# EAGLE design touch_board (EAGLE 9.6.2)
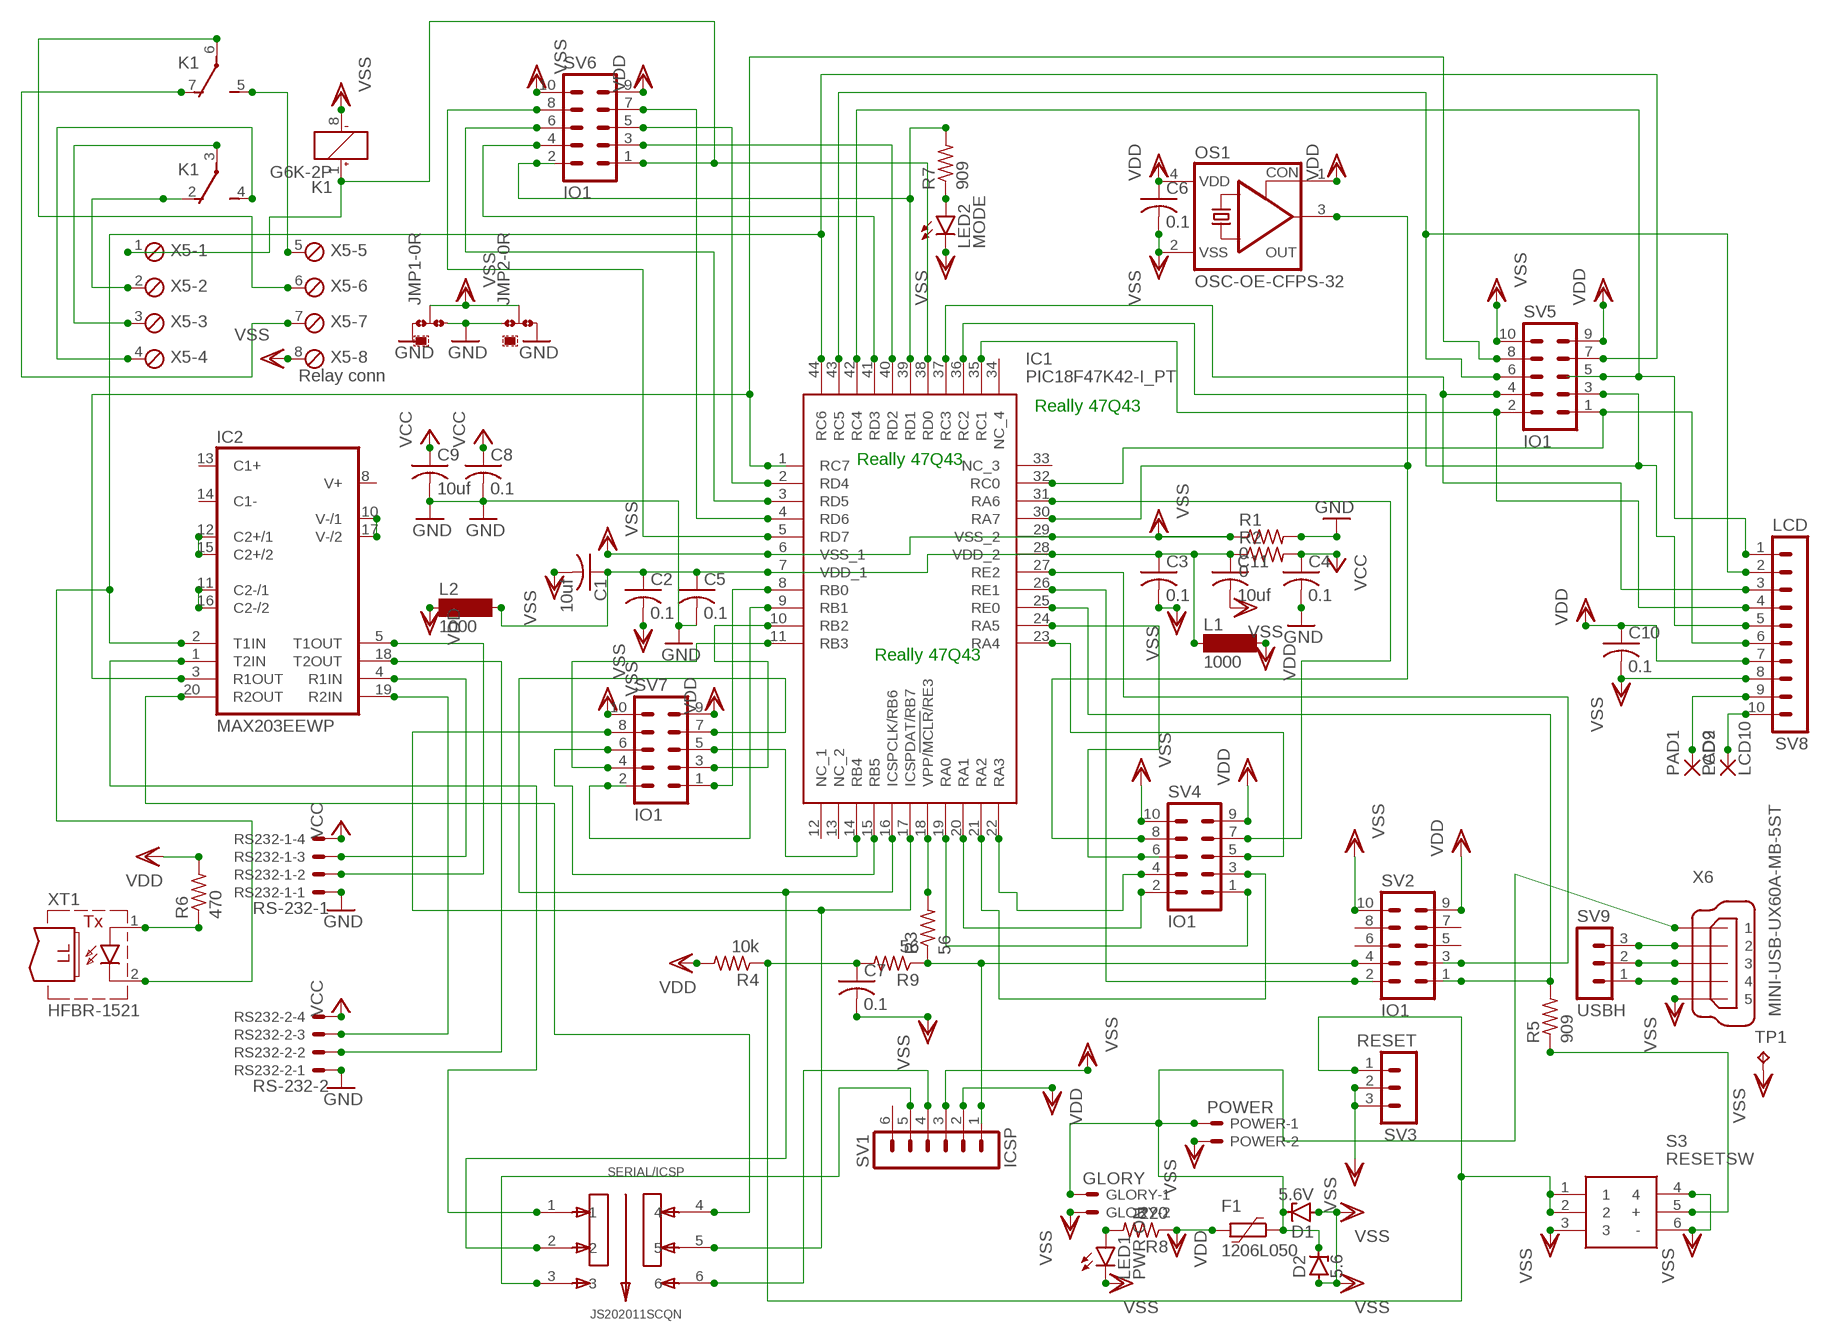
[diagram p0: schematic, sheet 1]

## Parts
C1  10uf  C-USC0805  [C0805]
C2  0.1  C-USC0805  [C0805]
C3  0.1  C-USC0805  [C0805]
C4  0.1  C-USC0805  [C0805]
C5  0.1  C-USC0805  [C0805]
C6  0.1  C-USC0805  [C0805]
C7  0.1  C-USC0805  [C0805]
C8  0.1  C-USC0805  [C0805]
C9  10uf  C-USC0805  [C0805]
C10  0.1  C-USC0805  [C0805]
C11  10uf  C-USC0805  [C0805]
D1  5.6V  ZENER-DIODEZD-7.5  [ZDIO-7.5]
D2  5.6  ZENER-DIODESMB  [SMB]
F1  1206L050  [1206L]
GLORY  GLORY  22-23-2021  [22-23-2021]
IC1  PIC18F47K42-I_PT  [QFP80P1200X1200X120-44N]
IC2  MAX203EEWP  [SO20L]
JMP1  0R-JUMPA  [A0R-JMP]
JMP2  0R-JUMPA  [A0R-JMP]
K1  G6K-2P  [G6K-2P]
L1  1000  SM-1206  [SM-1206]
L2  1000  SM-1206  [SM-1206]
LED1  PWR ON  LEDCHIPLED_1206  [CHIPLED_1206]
LED2  MODE  LEDCHIPLED_1206  [CHIPLED_1206]
OS1  OSC-OE-CFPS-32  [7.2X5.2-4-PAD]
PAD1  LCD9  SMD2  [SMD1,27-2,54]
PAD2  LCD10  SMD2  [SMD1,27-2,54]
POWER  POWER  22-23-2021  [22-23-2021]
R1  0  R-US_R0805  [R0805]
R2  0  R-US_R0805  [R0805]
R3  56  R-US_R0805  [R0805]
R4  10k  R-US_R0805  [R0805]
R5  909  R-US_R0805  [R0805]
R6  470  R-US_R0805  [R0805]
R7  909  R-US_R0805  [R0805]
R8  220  R-US_R0805  [R0805]
R9  56  R-US_R0805  [R0805]
RS232-1  RS-232-1  22-23-2041  [22-23-2041]
RS232-2  RS-232-2  22-23-2041  [22-23-2041]
S3  RESETSW  B3W-9000-Y1N  [B3W-9_1-LED]
SERIAL/ICSP  JS202011SCQN  [SW_JS202011SCQN]
SV1  ICSP  MA06-1  [MA06-1]
SV2  IO1  MA05-2  [MA05-2]
SV3  RESET  MA03-1  [MA03-1]
SV4  IO1  MA05-2  [MA05-2]
SV5  IO1  MA05-2  [MA05-2]
SV6  IO1  MA05-2  [MA05-2]
SV7  IO1  MA05-2  [MA05-2]
SV8  LCD  MA10-1  [MA10-1]
SV9  USBH  MA03-1  [MA03-1]
TP1  TPB1,27  [B1,27]
X5  Relay conn  MPT8  [8POL254]
X6  MINI-USB-UX60A-MB-5ST  [UX60A-MB-5ST]
XT1  HFBR-1521  [HFBR-15X3]

## Nets
GND: C4.2 C5.2 C8.2 C9.2 JMP1.1 JMP1.3 JMP2.1 JMP2.3 R1.2 RS232-1.1 RS232-2.1
N$1: IC1.30(RA7) OS1.3(OUT) SV4.8
N$2: R3.1 R9.1 SV1.1 SV2.4
N$3: IC1.18(VPP/!MCLR!/RE3) R3.2
N$4: IC1.25(RE0) R5.2 SV2.1
N$5: IC1.26(RE1) SV2.2
N$6: IC1.17(ICSPDAT/RB7) SERIAL/ICSP.5 SV7.8
N$7: IC1.16(ICSPCLK/RB6) SERIAL/ICSP.2 SV7.7
N$8: IC1.27(RE2) SV2.3
N$9: R5.1 S3.5(+)
N$10: IC1.39(RD1) R7.2 SV6.2
N$11: LED2.A R7.1
N$12: IC2.11(C2-/1) IC2.16(C2-/2)
N$13: IC2.10(V-/1) IC2.17(V-/2)
N$14: IC2.12(C2+/1) IC2.15(C2+/2)
N$15: IC2.5(T1OUT) RS232-1.2
N$16: IC2.18(T2OUT) RS232-2.2
N$17: IC2.4(R1IN) RS232-1.3
N$18: IC2.19(R2IN) RS232-2.3
N$20: IC2.1(T2IN) SERIAL/ICSP.1
N$21: IC1.1(RC7) IC2.3(R1OUT) SV5.8
N$22: IC2.20(R2OUT) SERIAL/ICSP.4
N$23: SERIAL/ICSP.6 SV1.4
N$24: IC1.44(RC6) IC2.2(T1IN) SV5.7 XT1.2(C)
N$25: R6.1 XT1.1(A)
N$26: IC1.19(RA0) SV4.1
N$27: IC1.20(RA1) SV4.2
N$28: IC1.21(RA2) SV4.3
N$29: IC1.22(RA3) SV4.4
N$30: IC1.23(RA4) SV4.5
N$31: IC1.31(RA6) SV4.7
N$32: IC1.24(RA5) SV4.6
N$33: IC1.32(RC0) SV5.1 SV8.6
N$34: IC1.35(RC1) SV5.2 SV8.4
N$35: IC1.36(RC2) SV5.3 SV8.5
N$36: IC1.37(RC3) SV5.4 SV8.3
N$37: LED1.A R8.2
N$38: IC1.43(RC5) SV5.6 SV8.2
N$39: K1.2(2:O) X5.2
N$40: IC1.40(RD2) SV6.3
N$41: IC1.41(RD3) SV6.4
N$42: IC1.2(RD4) SV6.5
N$43: IC1.3(RD5) SV6.6
N$44: IC1.4(RD6) SV6.7
N$45: IC1.5(RD7) SV6.8
N$46: IC1.8(RB0) SV7.1
N$47: IC1.9(RB1) SV7.2
N$48: IC1.10(RB2) SV7.3
N$49: IC1.11(RB3) SV7.4
N$50: IC1.14(RB4) SV7.5
N$51: IC1.15(RB5) SV7.6
N$52: IC1.38(RD0) K1.1(1:+) SV6.1 X5.1
N$53: K1.3(2:P) X5.3
N$54: K1.4(2:S) X5.4
N$55: K1.5(3:S) X5.5
N$56: K1.6(3:P) X5.6
N$57: K1.7(3:O) X5.7
N$58: C1.1 C2.1 C3.1 C5.1 C11.1 IC1.7(VDD_1) IC1.28(VDD_2) L1.1 L2.2 R2.1
N$59: SV9.3 X6.2
N$60: D1.C D2.C F1.1 GLORY.1 POWER.1 X6.1
N$61: SV9.2 X6.3
N$62: C7.1 R4.1 R9.2 S3.1 S3.2 SV3.1
N$63: IC1.42(RC4) SV5.5 SV8.1
N$64: SV9.1 X6.4
N$65: SERIAL/ICSP.3 SV1.5
N$66: PAD1.1(P) SV8.9
N$67: PAD2.1(P) SV8.10
VCC: C4.1 C8.1 C9.1 R2.2 RS232-1.4 RS232-2.4
VDD: C6.1 C10.1 F1.2 L1.2 L2.1 OS1.1(CON) OS1.4(VDD) R4.2 R6.2 R8.1 SV1.2 SV2.9 SV4.9 SV5.9 SV6.9 SV7.9 SV8.7
VSS: C1.2 C2.2 C3.2 C6.2 C7.2 C10.2 C11.2 D1.A D2.A GLORY.2 IC1.6(VSS_1) IC1.29(VSS_2) JMP1.2 JMP2.2 K1.8(1:-) LED1.C LED2.C OS1.2(VSS) POWER.2 R1.1 S3.3 S3.4 S3.6(-) SV1.3 SV2.10 SV3.2 SV3.3 SV4.10 SV5.10 SV6.10 SV7.10 SV8.8 TP1.TP X5.8 X6.5
Unconnected: IC1.12(NC_1) IC1.13(NC_2) IC1.33(NC_3) IC1.34(NC_4) IC2.8(V+) IC2.13(C1+) IC2.14(C1-) SV1.6 SV2.5 SV2.6 SV2.7 SV2.8

## Notes on the sheet
- Really 47Q43
- Really 47Q43
- Really 47Q43

## Power pins joined to a net without a drawn wire
GND: IC2.6(GND) IC2.9(GND)
VCC: IC2.7(VCC)

## Library data of the parts
C1-C11 = rcl:C-US: CAPACITOR, American symbol; SPICEPREFIX: C
D1 D2 = diode:ZENER-DIODE: Z-Diode
F1 = polyfuse-smd_10:?: Polyfuse Resettable PTC Source: http://www.littelfuse.com/products/resettable-ptcs.aspx; MF: Littelfuse; MPN: 1206L050; OC_FARNELL: 1596993; OC_NEWARK: 53M6118
GLORY POWER = con-molex:22-23-2021: .100" (2.54mm) Center Header - 2 Pin; MF: MOLEX; MPN: 22-23-2021; OC_FARNELL: 1462926; OC_NEWARK: 25C3832
IC1 = PIC18F47K42-I_PT:PIC18F47K42-I_PT: MICROCHIP - PIC18F47K42-I/PT - MCU, 8BIT, 64MHZ, TQFP-44 Source: Datasheet <https://www.microchip.com/wwwproducts/en/PIC18F47K42#additional-features>; DESCRIPTION: MICROCHIP - PIC18F47K42-I/PT - MCU, 8BIT, 64MHZ, TQFP-44; HEIGHT: 1.2mm; MANUFACTURER_NAME: Microchip; MANUFACTURER_PART_NUMBER: PIC18F47K42-I/PT; MOUSER_PART_NUMBER: 579-PIC18F47K42-I/PT; MOUSER_PRICE-STOCK: https://www.mouser.com/Search/Refine.aspx?Keyword=579-PIC18F47K42-I%2FPT
IC2 = maxim-10:MAX203*: RS232 TRANSEIVER
JMP1 JMP2 = jump-0r-smd:0R-JUMP: SMD 0R 0805 Jumper
K1 = relay:G6K: Low Signal Relay oeiwcsnts1.omron.com/.. D20G6K0100.pdf; MF: OMRON COMPONENTS USA; MPN: G6K-2P DC3; OC_FARNELL: 3937276; OC_NEWARK: 89C6482
L1 L2 = inductor-neosid:SM-1206: INDUCTOR SMD chip inductor; OC_FARNELL: unknown; OC_NEWARK: unknown
LED1 LED2 = led:LED: LED OSRAM: - CHIPLED LG R971, LG N971, LY N971, LG Q971, LY Q971, LO R971, LY R971 LH N974, LH R974 LS Q976, LO Q976, LY Q976 LO Q996 - Hyper CHIPLED LW Q18S LB Q993, LB Q99A, LB R99A - SideLED LS A670, LO A670, LY A670, LG A670, LP A670 LB A673, LV A673, LT A673, LW A673 LH A674 LY A675 LS A676, LA A676, LO A676, LY A676, LW A676 LS A679, LY A679, LG A679 - Hyper Micro SIDELED® LS Y876, LA Y876, LO Y876, LY Y876 LT Y87S - SmartLED LW L88C, LW L88S LB L89C, LB L89S, LG L890 LS L89K, LO L89K, LY L89K LS L896, LA L896, LO L896, LY L896 - TOPLED LS T670, LO T670, LY T670, LG T670, LP T670 LSG T670, LSP T670, LSY T670, LOP T670, LYG T670 LG T671, LOG T671, LSG T671 LB T673, LV T673, LT T673, LW T673 LH T674 LS T676, LA T676, LO T676, LY T676, LB T676, LH T676, LSB T676, LW T676 LB T67C, LV T67C, LT T67C, LS T67K, LO T67K, LY T67K, LW E67C LS E67B, LA E67B, LO E67B, LY E67B, LB E67C, LV E67C, LT E67C LW T67C LS T679, LY T679, LG T679 LS T770, LO T770, LY T770, LG T770, LP T770 LB T773, LV T773, LT T773, LW T773 LH T774 LS E675, LA E675, LY E675, LS T675 LS T776, LA T776, LO T776, LY T776, LB T776 LHGB T686 LT T68C, LB T68C - Hyper Mini TOPLED® LB M676 - Mini TOPLED Santana® LG M470 LS M47K, LO M47K, LY M47K Source: http://www.osram.convergy.de LUXEON: - LUMILED® LXK2-PW12-R00, LXK2-PW12-S00, LXK2-PW14-U00, LXK2-PW14-V00 LXK2-PM12-R00, LXK2-PM12-S00, LXK2-PM14-U00 LXK2-PE12-Q00, LXK2-PE12-R00, LXK2-PE12-S00, LXK2-PE14-T00, LXK2-PE14-U00 LXK2-PB12-K00, LXK2-PB12-L00, LXK2-PB12-M00, LXK2-PB14-N00, LXK2-PB14-P00, LXK2-PB14-Q00 LXK2-PR12-L00, LXK2-PR12-M00, LXK2-PR14-Q00, LXK2-PR14-R00 LXK2-PD12-Q00, LXK2-PD12-R00, LXK2-PD12-S00 LXK2-PH12-R00, LXK2-PH12-S00 LXK2-PL12-P00, LXK2-PL12-Q00, LXK2-PL12-R00 Source: www.luxeon.com KINGBRIGHT: KA-3528ASYC Source: www.kingbright.com
OS1 = IQD-Frequency-Products:OSC-OE: OSCILLATOR WITH OE
PAD1 PAD2 = wirepad:SMD2: SMD PAD
R1-R9 = rcl:R-US_: RESISTOR, American symbol; SPICEPREFIX: R
RS232-1 RS232-2 = con-molex:22-23-2041: .100" (2.54mm) Center Header - 4 Pin; MF: MOLEX; MPN: 22-23-2041; OC_FARNELL: 1462920; OC_NEWARK: 38C0355
S3 = SamacSys_Parts:B3W-9000-Y1N: Illuminated Tactile Switches Illuminated Ylw LED White Cap Source: Datasheet <http://www.mouser.com/ds/2/307/en-b3w-9-11824.pdf>; ALLIED_NUMBER: 70176005; ALLIED_PRICE-STOCK: https://www.alliedelec.com/omron-electronic-components-b3w-9000-y1n/70176005/; DESCRIPTION: Illuminated Tactile Switches Illuminated Ylw LED White Cap; HEIGHT: mm; MANUFACTURER_NAME: Omron Electronics; MANUFACTURER_PART_NUMBER: B3W-9000-Y1N; MOUSER_PART_NUMBER: 653-B3W-9000-Y1N; MOUSER_PRICE-STOCK: https://www.mouser.com/Search/Refine.aspx?Keyword=653-B3W-9000-Y1N; RS_PART_NUMBER: 0492777P; RS_PRICE-STOCK: http://uk.rs-online.com/web/p/products/0492777P
SERIAL/ICSP = JS202011SCQN_fixed:JS202011SCQN: JS Series DPDT On-On Gull Wing Surface Mount Subminiature Slide Switch; AVAILABILITY: Unavailable; DESCRIPTION: JS Series DPDT On-On Gull Wing Surface Mount Subminiature Slide Switch; MF: C&K; MP: JS202011SCQN; PACKAGE: None; PRICE: None
SV1 = con-lstb:MA06-1: PIN HEADER; OC_FARNELL: unknown; OC_NEWARK: unknown
SV2 SV4-SV7 = con-lstb:MA05-2: PIN HEADER; OC_FARNELL: unknown; OC_NEWARK: unknown
SV3 SV9 = con-lstb:MA03-1: PIN HEADER; OC_FARNELL: unknown; OC_NEWARK: unknown
SV8 = con-lstb:MA10-1: PIN HEADER; OC_FARNELL: unknown; OC_NEWARK: unknown
TP1 = testpad:TP: Test pad
X5 = con-phoenix-254:MPT8: PHOENIX CONNECTOR; OC_FARNELL: unknown; OC_NEWARK: unknown
X6 = con-hirose:MINI-USB-: MINI USB Connector Source: http://www.hirose.co.jp/cataloge_hp/e24000019.pdf; OC_FARNELL: unknown; OC_NEWARK: unknown
XT1 = fiber-optic-hp:HFBR-1521: TRANSMITTER low cost miniature fiber optic component, 5-MBd high performance link, vertical; MF: AGILENT TECHNOLOGIES; MPN: HFBR-1521; OC_FARNELL: 1173128; OC_NEWARK: 06F6050

## Board
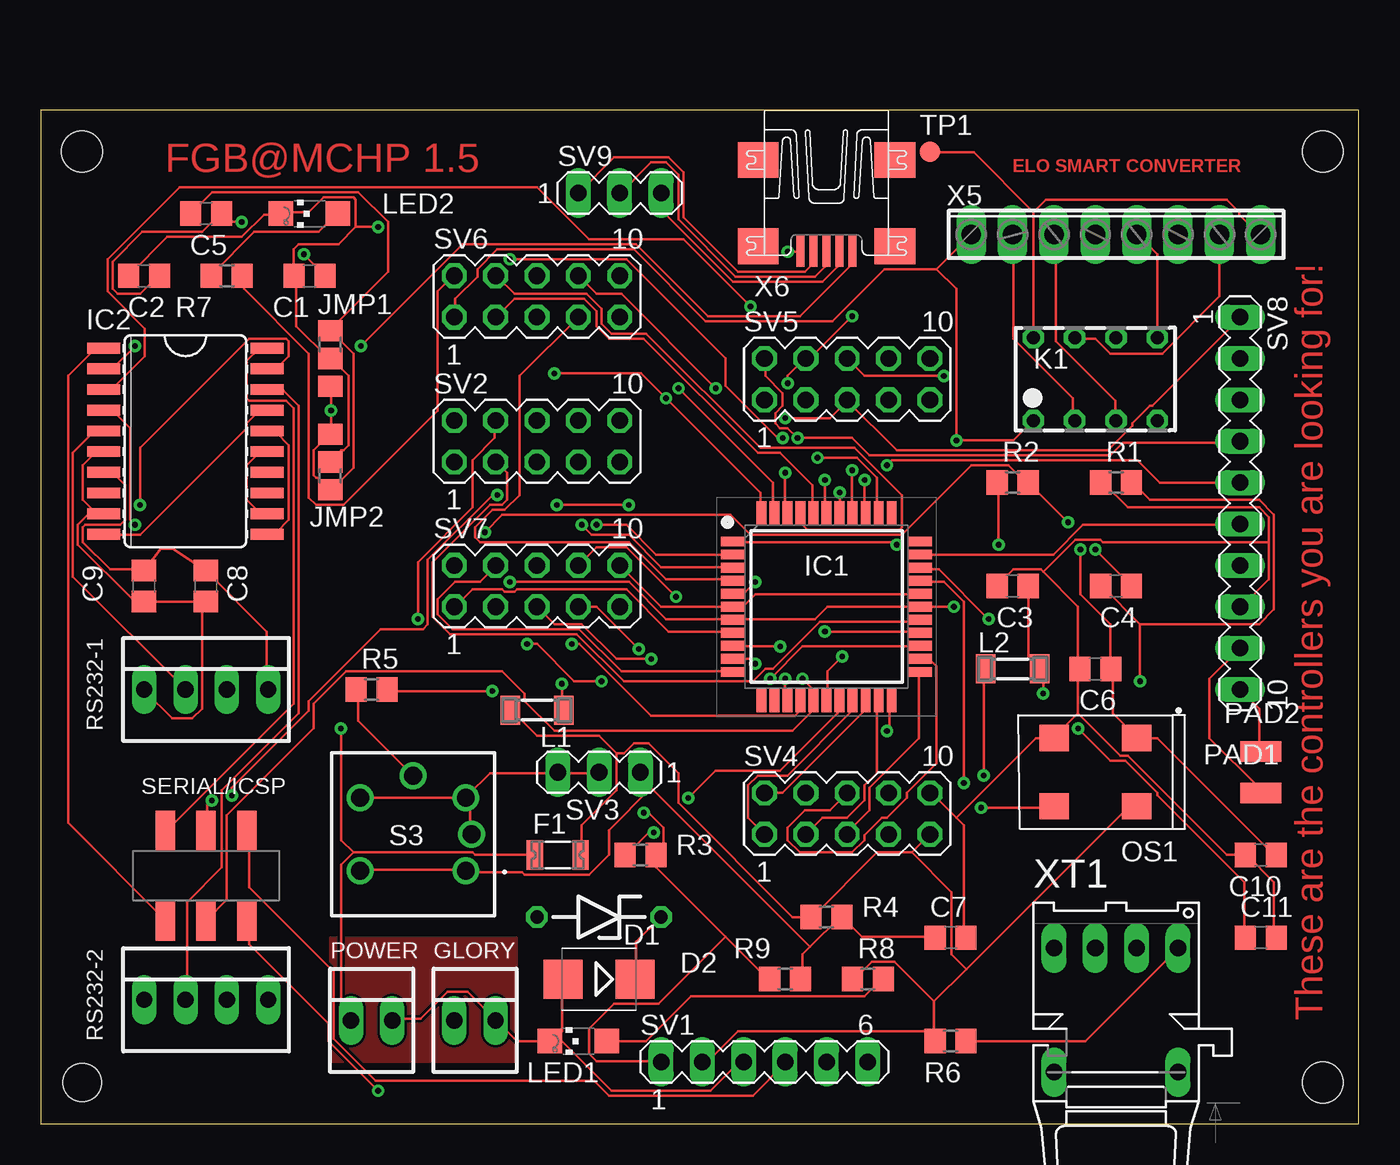
[diagram p1: board, top side]
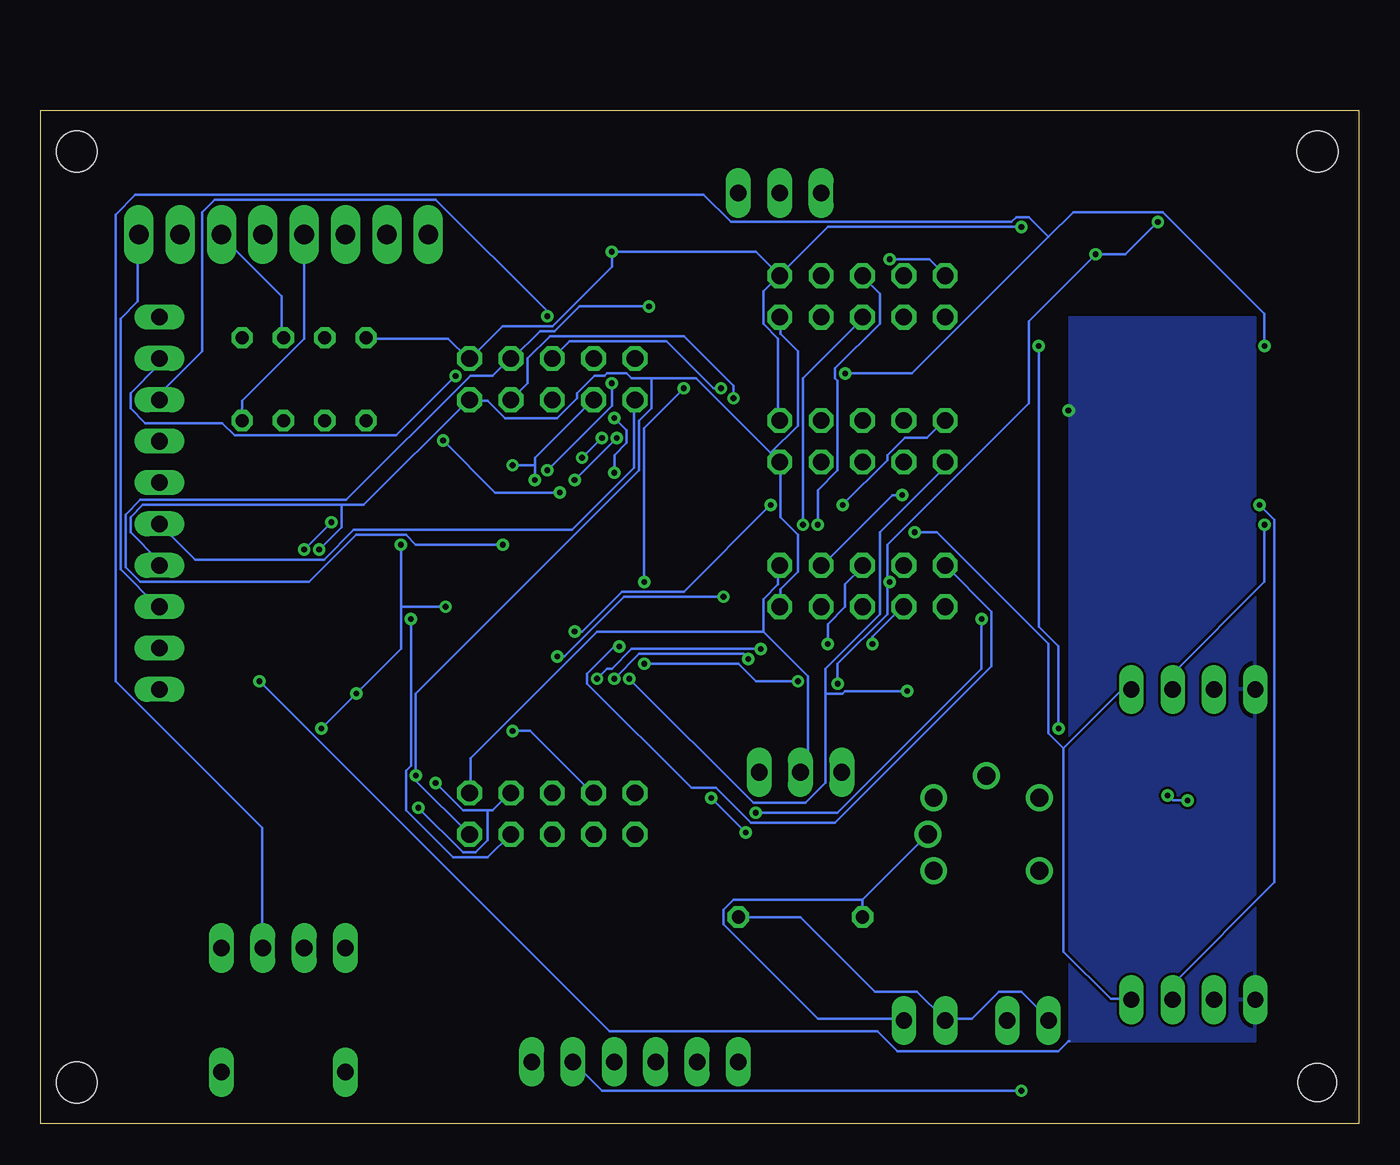
[diagram p2: board, bottom side, seen from below]

Size 80.95 x 62.22 mm. Coordinates in mm from the lower left corner, seen from the top.
Outline: 0,0 80.95,0 80.95,62.22 0,62.22 0,0
Copper layers (1*16): Top 0.035mm / dielectric 1.5mm / Bottom 0.035mm
Design rules "default": minimum track width 6mil, minimum drill 0.35mm, track to track 6mil, track to pad 6mil, pad to pad 6mil, via to via 6mil, smd to smd 6mil, copper to edge 40mil, drill to drill 6mil, minimum pad ring 10mil, minimum via ring 8mil, stop-mask expansion 4mil, vias tented up to drill 0mil, thermal gap 10mil
Holes 2.35 mm at 2.54,2.54
Holes 2.5 mm at 78.74,2.54 78.74,59.69 2.54,59.69

### Footprints (pad centres in the part's own frame; a part is rotated, then mirrored left to right if it is on the bottom)
C0805 = smd 1.3 x 1.5: 1 -0.95,0; 2 0.95,0
ZDIO-7.5 = drill 0.813 octagon: A 3.81,0; C -3.81,0
SMB = smd 2.4 x 2.4: A 2.2,0; C -2.2,0
1206L = smd 1 x 1.8: 1 -1.4,0; 2 1.4,0
22-23-2021 = drill 1 long: 1 -1.27,0; 2 1.27,0
QFP80P1200X1200X120-44N = smd 1.475 x 0.6: 1 -5.738,4; 2 -5.738,3.2; 3 -5.738,2.4; 4 -5.738,1.6; 5 -5.738,0.8; 6 -5.738,0; 7 -5.738,-0.8; 8 -5.738,-1.6; 9 -5.738,-2.4; 10 -5.738,-3.2; 11 -5.738,-4; 23 5.738,-4; 24 5.738,-3.2; 25 5.738,-2.4; 26 5.738,-1.6; 27 5.738,-0.8; 28 5.738,0; 29 5.738,0.8; 30 5.738,1.6; 31 5.738,2.4; 32 5.738,3.2; 33 5.738,4 | smd 0.6 x 1.475: 12 -4,-5.738; 13 -3.2,-5.738; 14 -2.4,-5.738; 15 -1.6,-5.738; 16 -0.8,-5.738; 17 0,-5.738; 18 0.8,-5.738; 19 1.6,-5.738; 20 2.4,-5.738; 21 3.2,-5.738; 22 4,-5.738; 34 4,5.738; 35 3.2,5.738; 36 2.4,5.738; 37 1.6,5.738; 38 0.8,5.738; 39 0,5.738; 40 -0.8,5.738; 41 -1.6,5.738; 42 -2.4,5.738; 43 -3.2,5.738; 44 -4,5.738
SO20L = smd 0.66 x 2.032: 1 -5.715,-5.029; 2 -4.445,-5.029; 3 -3.175,-5.029; 4 -1.905,-5.029; 5 -0.635,-5.029; 6 0.635,-5.029; 7 1.905,-5.029; 8 3.175,-5.029; 9 4.445,-5.029; 10 5.715,-5.029; 11 5.715,5.029; 12 4.445,5.029; 13 3.175,5.029; 14 1.905,5.029; 15 0.635,5.029; 16 -0.635,5.029; 17 -1.905,5.029; 18 -3.175,5.029; 19 -4.445,5.029; 20 -5.715,5.029
A0R-JMP = smd 1.5 x 1.3: 1 0,1.7; 2 0,0; 3 0,-1.7
G6K-2P = drill 0.8 octagon: 1 -2.54,-2.54; 2 0,-2.54; 3 2.54,-2.54; 4 5.08,-2.54; 5 5.08,2.54; 6 2.54,2.54; 7 0,2.54; 8 -2.54,2.54
SM-1206 = smd 1.2 x 1.8: 1 -1.65,0; 2 1.65,0
CHIPLED_1206 = smd 1.5 x 1.5: A 0,-1.75; C 0,1.75
7.2X5.2-4-PAD = smd 1.8 x 1.6: 1 -2.54,-2.1; 2 2.54,-2.1; 3 2.54,2.1; 4 -2.54,2.1
SMD1,27-2,54 = smd 1.27 x 2.54: 1 0,0
R0805 = smd 1.3 x 1.5: 1 -0.95,0; 2 0.95,0
22-23-2041 = drill 1 long: 1 -3.81,0; 2 -1.27,0; 3 1.27,0; 4 3.81,0
B3W-9_1-LED = drill 1.1 pad 1.65: 1 3.25,-2.25; 2 -3.25,-2.25; 3 3.25,2.25; 4 -3.25,2.25; 5 0,3.6; 6 3.6,0
SW_JS202011SCQN = smd 1.2 x 2.5: 1 -2.5,-2.75; 2 0,-2.75; 3 2.5,-2.75; 4 -2.5,2.75; 5 0,2.75; 6 2.5,2.75
MA06-1 = drill 1.016 long: 1 -6.35,0; 2 -3.81,0; 3 -1.27,0; 4 1.27,0; 5 3.81,0; 6 6.35,0
MA05-2 = drill 1.016 octagon: 1 -5.08,-1.27; 2 -5.08,1.27; 3 -2.54,-1.27; 4 -2.54,1.27; 5 0,-1.27; 6 0,1.27; 7 2.54,-1.27; 8 2.54,1.27; 9 5.08,-1.27; 10 5.08,1.27
MA03-1 = drill 1.016 long: 1 -2.54,0; 2 0,0; 3 2.54,0
MA10-1 = drill 1.016 long: 1 -11.43,0; 2 -8.89,0; 3 -6.35,0; 4 -3.81,0; 5 -1.27,0; 6 1.27,0; 7 3.81,0; 8 6.35,0; 9 8.89,0; 10 11.43,0
B1,27 = smd 1.27 x 1.27: TP 0,0
8POL254 = drill 1.2 long: 1 -8.89,0; 2 -6.35,0; 3 -3.81,0; 4 -1.27,0; 5 1.27,0; 6 3.81,0; 7 6.35,0; 8 8.89,0
UX60A-MB-5ST = smd 2 x 0.5: 1 2.25,1.6; 2 2.25,0.8; 3 2.25,0; 4 2.25,-0.8; 5 2.25,-1.6 | smd 2.2 x 2.5: M1 -3.3,-4.2; M2 -3.3,4.2; M3 2,4.2; M4 2,-4.2
HFBR-15X3 = drill 1.016 long: 1 3.81,9.525; 2 1.27,9.525; 3 -1.27,9.525; 4 -3.81,9.525; 5 -3.81,1.905; 8 3.81,1.905

### Placement (x,y rotation side)
C1  16.51,52.07 180 top
C2  6.35,52.07 180 top
C3  59.69,33.02 180 top
C4  66.04,33.02 180 top
C5  10.16,55.88 180 top
C6  64.77,27.94 180 top
C7  55.88,11.43 0 top
C8  10.16,33.02 270 top
C9  6.35,33.02 270 top
C10  74.93,16.51 180 top
C11  74.93,11.43 0 top
D1  34.29,12.7 180 top
D2  34.29,8.89 180 top
F1  31.75,16.51 0 top
GLORY  26.67,6.35 0 top
IC1  48.26,31.75 0 top
IC2  8.89,41.91 270 top
JMP1  17.78,46.99 0 top
JMP2  17.78,40.64 180 top
K1  63.5,45.72 0 top
L1  30.48,25.4 180 top
L2  59.69,27.94 0 top
LED1  33.02,5.08 90 top
LED2  16.51,55.88 90 top
OS1  64.77,21.59 180 top
PAD1  74.93,20.32 90 top
PAD2  74.93,22.86 90 top
POWER  20.32,6.35 0 top
R1  66.04,39.37 0 top
R2  59.69,39.37 0 top
R3  36.83,16.51 180 top
R4  48.26,12.7 180 top
R5  20.32,26.67 0 top
R6  55.88,5.08 180 top
R7  11.43,52.07 0 top
R8  50.8,8.89 0 top
R9  45.72,8.89 0 top
RS232-1  10.16,26.67 0 top
RS232-2  10.16,7.62 0 top
S3  22.86,17.78 0 top
SERIAL/ICSP  10.16,15.24 0 top
SV1  44.45,3.81 0 top
SV2  30.48,41.91 0 top
SV3  34.29,21.59 180 top
SV4  49.53,19.05 0 top
SV5  49.53,45.72 0 top
SV6  30.48,50.8 0 top
SV7  30.48,33.02 0 top
SV8  73.66,38.1 270 top
SV9  35.56,57.15 0 top
TP1  54.61,59.69 0 top
X5  66.04,54.61 0 top
X6  48.26,55.88 270 top
XT1  66.04,1.27 0 top

### Tracks (layer width: path | path; a pad name or v marks a point on that pad's centre or on a via)
GND  (via drill 0.35)
  Top 0.152: JMP1.3 17.83,45.16 v17.83,43.79 17.83,42.42 JMP2.3 17.68,42.27 16.76,41.35 16.76,39.83 16.92,39.67 17.07,39.67 17.68,39.06 JMP2.1 17.83,38.91 19.2,40.28 19.2,47.3 17.83,48.67 JMP1.1 17.83,48.82 21.34,52.32 21.34,55.37 19.51,57.2 10.52,57.2 9.3,55.98 C5.2 | 67.51,30.68 65.23,32.97 C4.2 | 67.51,30.68 74.83,30.68 75.74,31.6 75.74,37.39 74.83,38.3 68.12,38.3 67.06,39.37 R1.2 | 9.91,32.05 10.06,32.05 C8.2 9.91,32.05 | 9.91,32.05 6.4,32.05 C9.2 6.25,32.21 5.64,32.21 2.29,35.56 2.29,36.78 3.2,37.69 | 3.2,37.69 2.59,38.3 2.59,40.44 3.35,41.2 3.81,41.2 IC2.6 | 3.2,37.69 3.35,37.54 3.81,37.54 IC2.9 3.2,37.69 | 9.91,32.05 9.91,25.5 9.3,24.89 8.08,24.89 6.4,26.57 RS232-1.1 | v67.51,27.18 67.51,30.68
  Bottom 0.152: v67.51,27.18 46.02,5.69 29.57,5.69 28.35,4.47 18.44,4.47 17.83,5.08 17.78,5.08 | v17.83,43.79 17.78,43.79
  pour Bottom: 6.35,49.53 17.78,49.53 17.78,5.08 6.35,5.08
N$1  (via drill 0.35)
  Top 0.152: v56.69,20.93 56.69,32.05 55.47,33.27 54.1,33.27 IC1.30 | v57.76,19.41 62.18,19.41 OS1.3
  Bottom 0.152: v56.69,20.93 55.02,19.25 53.49,19.25 | 53.49,19.25 53.19,19.25 52.12,20.32 SV4.8 | v57.76,19.41 55.02,16.66 54.25,16.66 53.49,17.42 53.49,19.25
N$2  (via drill 0.35)
  Top 0.152: 37.79,16.51 37.79,15.75 42.06,11.48 | 42.06,11.48 44.65,8.89 R9.1 | v23.16,30.99 23.16,34.49 26.52,37.85 26.52,40.74 27.89,42.11 27.89,43.18 SV2.4 | v37.03,19.1 37.34,19.1 38.25,18.19 38.25,16.97 37.79,16.51 | 37.79,16.51 R3.1 | 42.06,11.48 37.95,7.37 35.2,7.37 33.68,5.84 33.68,4.32 34.14,3.86 38.1,3.86 SV1.1
  Bottom 0.152: v23.16,30.99 23.16,27.94 32,19.1 v37.03,19.1
N$3  (via drill 0.35)
  Top 0.152: v39.78,20.02 41.45,21.69 45.41,21.69 48.92,25.2 48.92,25.96 IC1.18 | v37.64,17.88 37.34,17.88 35.97,16.51 R3.2
  Bottom 0.152: v37.64,17.88 v39.78,20.02
N$4  (via drill 0.35)
  Top 0.152: v44.81,27.33 46.79,29.31 53.95,29.31 IC1.25 | v27.74,26.57 21.34,26.57 R5.2
  Bottom 0.152: v44.81,27.33 37.19,19.71 33.98,19.71 32.77,20.93 32.77,26.42 | 32.77,26.42 32.77,27.94 29.41,31.29 29.41,36.32 25.45,40.28 25.45,40.59 SV2.1 | v27.74,26.57 31.55,26.57 31.7,26.42 32.77,26.42
N$5  (via drill 0.35)
  Top 0.152: v48.16,30.23 53.95,30.23 IC1.26 | v31.7,38 v36.12,38
  Bottom 0.152: v48.16,30.23 47.7,30.23 45.26,32.66 41.45,32.66 v36.12,38 | v31.7,38 28.96,40.74 28.96,41.05 27.89,42.11 26.52,42.11 25.45,43.18 SV2.2
N$6  (via drill 0.35)
  Top 0.152: v49.23,28.7 48.31,27.79 48.31,26.11 IC1.17 | v39.01,32.36 35.97,35.41 34.14,35.41 SV7.8 | v10.52,19.86 10.21,19.56 10.21,18.03 SERIAL/ICSP.5 | v11.74,20.17 11.74,20.62 16.46,25.35 16.46,25.96 20.88,30.38 23.47,30.38 23.77,30.68 23.77,34.65 27.74,38.61 v28.04,38.61
  Bottom 0.152: v49.23,28.7 48.77,28.7 45.11,32.36 v39.01,32.36 | v10.52,19.86 11.43,19.86 v11.74,20.17 | v28.04,38.61 28.65,38.61 32.92,34.34 SV7.8
N$7  (via drill 0.35)
  Top 0.152: SERIAL/ICSP.2 10.21,12.55 11.43,13.77 11.43,18.95 16.76,24.28 16.76,25.81 18.74,27.79 28.35,27.79 29.72,26.42 29.72,25.96 31.55,24.13 46.18,24.13 47.4,25.35 47.4,25.96 IC1.16 47.4,26.11 47.4,26.72 v46.79,27.33 | SV7.7 34.14,31.75 v36.73,29.16
  Bottom 0.152: v36.73,29.16 44.65,29.16 45.87,27.94 46.18,27.94 v46.79,27.33
N$8
  Top 0.152: IC1.27 53.95,30.84 47.85,30.84 44.96,27.94 44.5,27.94 43.74,27.18 35.81,27.18 32.92,30.07 25.15,30.07 24.08,31.14 24.08,34.49 27.58,38 28.35,38 28.65,38.3 28.65,39.98 28.04,40.59 SV2.3
N$9
  Top 0.152: R5.1 19.51,26.57 19.51,24.74 S3.5
N$10  (via drill 0.35)
  Top 0.152: v48.16,39.52 48.16,37.54 IC1.39 | v45.57,42.11 45.26,42.11 42.06,45.31 42.06,46.99 35.97,53.09 v28.8,53.09 | R7.2 12.5,52.02 12.5,51.26 16.46,47.3 16.46,38.46 16.92,38 18.59,38 24.38,43.79 24.38,51.11 25.3,52.02 SV6.2
  Bottom 0.152: v45.57,42.11 v48.16,39.52 | v28.8,53.09 26.36,53.09 25.45,52.17 SV6.2
N$11
  Top 0.152: R7.1 10.52,52.17 13.11,54.76 17.07,54.76 18.14,55.83 LED2.A
N$12
  Top 0.152: IC2.11 14.02,36.32 14.48,36.32 15.24,37.08 15.24,41.66 14.48,42.42 14.02,42.42 IC2.16
N$13
  Top 0.152: IC2.10 3.96,36.17 6.1,36.17 12.65,42.72 12.65,43.03 13.41,43.79 13.87,43.79 IC2.17
N$14
  Top 0.152: IC2.12 13.87,37.54 13.41,37.54 12.65,38.3 12.65,40.44 13.41,41.2 13.87,41.2 IC2.15
N$15
  Top 0.152: RS232-1.2 1.98,33.58 1.98,41.2 3.2,42.42 3.81,42.42 IC2.5
N$16
  Top 0.152: IC2.18 14.02,45.01 14.94,45.01 15.85,44.09 15.85,25.2 11.12,20.47 11.12,15.75 8.99,13.61 8.99,7.67 RS232-2.2
N$17  (via drill 0.35)
  Top 0.152: v5.79,36.78 5.49,37.08 5.49,42.72 4.42,43.79 3.96,43.79 IC2.4
  Bottom 0.152: v5.79,36.78 5.79,33.27 11.43,27.63 RS232-1.3
N$18  (via drill 0.35)
  Top 0.152: v6.1,38 6.1,41.5 12.8,48.21 15.09,48.21 15.24,48.06 15.24,47.14 14.48,46.38 14.02,46.38 IC2.19
  Bottom 0.152: v6.1,38 5.18,37.08 5.18,14.83 11.43,8.58 RS232-2.3
N$20
  Top 0.152: IC2.1 3.81,47.6 3.35,47.6 1.68,45.92 1.68,18.49 7.62,12.55 SERIAL/ICSP.1
N$21  (via drill 0.35)
  Top 0.152: v52.58,35.56 52.43,35.71 42.67,35.71 IC1.1 | v43.59,50.19 39.47,54.3 33.68,54.3 30.48,57.51 8.53,57.51 4.12,53.09 4.12,51.11 6.4,48.82 6.4,47.14 4.42,45.16 3.96,45.16 IC2.3
  Bottom 0.152: v52.58,35.56 57.91,35.56 58.52,36.17 61.57,36.17 64.47,33.27 74.83,33.27 75.74,34.19 75.74,37.39 74.83,38.3 62.18,38.3 54.56,45.92 53.19,45.92 52.12,46.99 SV5.8 51.97,46.99 50.29,48.67 49.38,48.67 47.85,50.19 v43.59,50.19
N$22
  Top 0.152: IC2.20 13.87,47.6 13.41,47.6 12.65,46.84 12.65,44.55 12.8,44.4 15.09,44.4 15.54,43.94 15.54,25.81 7.77,18.03 SERIAL/ICSP.4
N$23
  Top 0.152: SERIAL/ICSP.6 12.8,17.88 12.8,14.53 17.98,9.35 17.98,5.23 20.57,2.64 33.98,2.64 34.9,1.73 43.74,1.73 45.72,3.71 SV1.4
N$24  (via drill 0.35)
  Top 0.152: IC1.44 44.2,37.54 44.2,38.76 v38.41,44.55 36.88,46.08 v31.55,46.08 | v5.79,47.75 4.42,46.38 3.96,46.38 IC2.2
  Bottom 0.152: v38.41,44.55 38.41,45.31 41.45,48.36 49.68,48.36 51.05,46.99 51.05,45.47 SV5.7 | v5.79,47.75 5.79,49.73 12.04,55.98 17.53,55.98 19.05,54.46 | 19.05,54.46 27.43,46.08 v31.55,46.08 | 19.05,54.46 20.27,55.68 21.03,55.68 21.34,55.37 38.56,55.37 40.23,57.05 75.13,57.05 76.35,55.83 76.35,27.18 67.36,18.19 67.36,10.87 XT1.2
N$25
  Top 0.152: R6.1 64.16,5.08 69.8,10.72 XT1.1
N$26
  Top 0.152: SV4.1 43.43,18.8 43.43,20.78 44.04,21.39 45.87,21.39 49.84,25.35 49.84,25.96 IC1.19
N$27
  Top 0.152: SV4.2 45.57,20.32 50.6,25.35 50.6,25.96 IC1.20
N$28
  Top 0.152: SV4.3 48.01,18.8 49.53,18.8 50.6,19.86 50.6,20.78 51.36,21.54 51.36,25.96 IC1.21
N$29  (via drill 0.35)
  Top 0.152: v51.97,24.13 52.12,24.28 52.12,25.96 IC1.22
  Bottom 0.152: v51.97,24.13 50.9,24.13 47.09,20.32 SV4.4
N$30
  Top 0.152: IC1.23 53.95,27.63 53.95,23.67 50.9,20.62 50.9,19.25 49.53,17.88 SV4.5
N$31  (via drill 0.35)
  Top 0.152: v58.22,30.99 55.17,34.04 54.1,34.04 IC1.31
  Bottom 0.152: v58.22,30.99 58.22,22 58.52,21.69 58.52,19.25 55.63,16.36 53.49,16.36 SV4.7
N$32
  Top 0.152: SV4.6 48.46,19.25 46.94,19.25 45.87,18.19 45.87,17.42 46.63,16.66 49.84,16.66 50.6,17.42 50.6,17.73 51.66,18.8 51.97,18.8 53.19,20.02 53.19,20.32 55.02,22.15 55.02,28.09 54.56,28.55 54.1,28.55 IC1.24
N$33
  Top 0.152: IC1.32 54.1,34.95 62.18,34.95 64.01,36.78 73.61,36.78 SV8.6
  Bottom 0.152: SV8.6 71.48,34.65 63.55,34.65 61.72,36.47 48.31,36.47 44.5,40.28 44.5,44.4 SV5.1
N$34  (via drill 0.35)
  Top 0.152: v47.7,40.89 50.14,40.89 51.36,39.67 51.36,37.54 IC1.35 | SV5.2 44.5,46.99 44.5,45.92 45.57,44.86 45.57,44.09 45.11,43.64 45.11,43.03 45.41,42.72 45.87,42.72 v46.48,42.11 49.84,42.11 50.9,41.05 65.68,41.05 66.45,41.81 73.61,41.81 SV8.4
  Bottom 0.152: v46.48,42.11 v47.7,40.89
N$35  (via drill 0.35)
  Top 0.152: v50.6,39.52 50.6,37.54 IC1.36 | SV8.5 68.73,39.37 67.36,40.74 52.27,40.74 v51.97,40.44
  Bottom 0.152: 50.6,40.44 50.6,40.89 47.09,44.4 SV5.3 | 50.6,40.44 v50.6,39.52 | 50.6,40.44 v51.97,40.44
N$36  (via drill 0.35)
  Top 0.152: v49.84,40.13 49.84,37.54 IC1.37 | v45.87,45.47 45.87,45.92 46.94,46.99 SV5.4 47.24,46.99 v49.84,49.58
  Bottom 0.152: v49.84,40.13 45.87,44.09 v45.87,45.47 | v49.84,49.58 49.84,49.89 56.69,56.74 70.26,56.74 71.02,55.98 71.02,47.45 73.61,44.86 73.61,44.55 SV8.3
N$37
  Top 0.152: LED1.A 37.19,5.08 39.93,7.82 50.6,7.82 51.66,8.89 R8.2
N$38  (via drill 0.35)
  Top 0.152: v39.17,45.16 44.96,39.37 44.96,37.54 IC1.43 | v55.47,45.92 50.6,45.92 SV5.6
  Bottom 0.152: v39.17,45.16 39.62,45.16 42.52,48.06 48.46,48.06 SV5.6 | v55.47,45.92 59.13,42.27 69.04,42.27 69.8,43.03 74.52,43.03 75.44,43.94 75.44,44.86 73.76,46.53 73.76,46.99 SV8.2
N$39
  Top 0.152: K1.2 63.4,43.18 63.4,44.55 59.74,48.21 59.74,54.61 X5.2
N$40
  Top 0.152: IC1.40 47.4,37.54 47.4,39.22 45.41,41.2 44.04,41.2 37.03,48.21 34.9,48.21 34.14,48.97 34.14,49.89 33.38,50.65 29.11,50.65 28.04,49.58 SV6.3
N$41
  Top 0.152: IC1.41 46.79,37.39 46.79,36.78 47.09,36.47 52.73,36.47 52.88,36.63 52.88,38.61 49.99,41.5 44.2,41.5 37.19,48.51 35.05,48.51 34.44,49.12 34.44,50.04 33.53,50.95 29.11,50.95 28.04,52.02 SV6.4
N$42  (via drill 0.35)
  Top 0.152: v34.14,36.78 35.97,36.78 37.79,34.95 IC1.2
  Bottom 0.152: v34.14,36.78 34.14,45.77 30.48,49.43 SV6.5
N$43  (via drill 0.35)
  Top 0.152: v33.22,36.78 33.83,36.17 36.12,36.17 38.1,34.19 42.52,34.19 IC1.3
  Bottom 0.152: v33.22,36.78 33.22,38.91 32,40.13 32,45.62 32.16,45.77 32.16,46.38 29.41,49.12 29.41,50.95 30.48,52.02 SV6.6
N$44
  Top 0.152: SV6.7 29.41,45.92 29.41,38.61 28.5,37.69 27.74,37.69 26.67,36.63 26.67,36.02 26.98,35.71 36.12,35.71 38.41,33.43 42.52,33.43 IC1.4
N$45  (via drill 0.35)
  Top 0.152: v43.89,33.27 43.28,32.66 42.67,32.66 IC1.5 | v41.45,45.16 35.66,50.95 34.14,50.95 SV6.8
  Bottom 0.152: v43.89,33.27 43.89,42.72 v41.45,45.16
N$46
  Top 0.152: IC1.8 42.52,30.23 38.56,30.23 35.97,32.82 29.26,32.82 29.11,32.66 28.5,32.66 28.35,32.82 26.52,32.82 25.45,31.75 SV7.1
N$47  (via drill 0.35)
  Top 0.152: v45.41,29.31 42.67,29.31 IC1.9
  Bottom 0.152: v45.41,29.31 45.72,29.31 47.4,27.63 47.4,27.03 41,20.62 39.47,20.62 37.34,18.49 32.16,18.49 22.55,28.09 22.55,31.45 SV7.2
N$48  (via drill 0.35)
  Top 0.152: v43.89,28.24 43.59,28.55 42.67,28.55 IC1.10 | v34.44,27.18 32.77,27.18 30.48,29.46 v29.87,29.46
  Bottom 0.152: v43.89,28.24 38.1,28.24 37.03,27.18 v34.44,27.18 | v29.87,29.46 29.87,29.92 28.04,31.75 SV7.3
N$49
  Top 0.152: IC1.11 42.52,27.79 35.66,27.79 33.07,30.38 25.3,30.38 24.38,31.29 24.38,32.21 25.45,33.27 26.98,33.27 27.89,34.19 SV7.4
N$50  (via drill 0.35)
  Top 0.152: v45.72,27.33 45.72,26.11 IC1.14 | v37.49,28.55 35.36,28.55 33.22,30.68 31.55,30.68 SV7.5
  Bottom 0.152: v45.72,27.33 44.2,28.85 37.79,28.85 v37.49,28.55
N$51  (via drill 0.35)
  Top 0.152: v32.61,29.46 33.07,29.46 37.49,25.04 46.33,25.04 46.63,25.35 46.63,25.96 IC1.15
  Bottom 0.152: v32.61,29.46 32.61,30.68 31.55,31.75 31.55,33.12 30.48,34.19 SV7.6
N$52  (via drill 0.35)
  Top 0.152: v49.07,38.76 49.07,37.54 IC1.38 | K1.1 59.74,41.96 v56.24,41.96 56.24,51.26 55.02,52.48 | 55.02,52.48 51.82,52.48 48.62,49.28 40.84,49.28 36.42,53.7 28.04,53.7 26.82,52.48 26.82,52.02 25.45,50.65 25.45,49.58 SV6.1 | X5.1 55.02,52.48
  Bottom 0.152: v49.07,38.76 53.04,38.76 v56.24,41.96
N$53
  Top 0.152: K1.3 65.99,43.18 65.99,44.4 62.33,48.06 62.33,54.61 X5.3
N$54
  Bottom 0.152: K1.4 68.58,44.4 64.77,48.21 X5.4
N$55
  Top 0.152: K1.5 68.58,53.39 67.36,54.61 X5.5
N$56
  Bottom 0.152: K1.6 66.14,48.36 66.14,50.8 69.95,54.61 X5.6
N$57
  Top 0.152: X5.7 72.39,50.8 68.89,47.3 65.68,47.3 64.77,48.21 63.55,48.21 K1.7
N$58  (via drill 0.35)
  Top 0.152: C2.1 7.16,52.02 6.1,50.95 4.72,50.95 4.42,51.26 4.42,52.93 6.25,54.76 9.91,54.76 10.97,55.83 C5.1 11.12,55.83 11.58,55.37 v12.34,55.37 | v16.15,53.39 17.37,52.17 C1.1 | v32,27.03 32,25.5 L1.1 | v63.7,24.28 65.68,22.3 66.6,22.3 68.58,20.32 68.58,20.17 73.91,14.83 73.91,11.48 C11.1 | v61.57,26.42 61.57,27.79 61.42,27.94 L2.2 61.26,27.94 60.65,28.55 60.65,32.97 C3.1 | v58.83,35.56 58.83,39.37 R2.1 | v56.08,31.75 IC1.28 48.31,31.75 47.55,30.99 42.67,30.99 IC1.7 42.52,30.99 38.41,30.99 36.12,33.27 v28.8,33.27
  Bottom 0.152: v12.34,55.37 14.33,53.39 v16.15,53.39 20.27,49.28 20.27,44.25 28.96,35.56 28.96,33.27 | v32,27.03 32,28.24 28.96,31.29 28.96,33.27 | v63.7,24.28 v61.57,26.42 58.83,29.16 58.83,31.75 | 58.83,31.75 v58.83,35.56 | 58.83,31.75 v56.08,31.75 | v28.8,33.27 28.96,33.27
N$59
  Top 0.152: SV9.3 38.1,56.13 42.52,51.71 48.01,51.71 48.92,52.63 48.92,53.54 X6.2
N$60  (via drill 0.35)
  Top 0.152: F1.1 26.67,16.51 26.52,16.66 19.2,16.66 | 19.2,16.66 18.44,15.9 18.44,7.06 19.05,6.45 POWER.1 | v19.66,47.75 25.91,54 36.58,54 41,49.58 46.63,49.58 49.84,52.78 49.84,53.54 X6.1 | v18.44,24.28 18.44,17.42 19.2,16.66 | D2.C 36.58,8.89 36.58,11.18 D1.C
  Bottom 0.152: v19.66,47.75 19.66,30.53 18.44,29.31 v18.44,24.28 | POWER.1 19.05,6.45 20.73,8.13 22.1,8.13 23.77,6.45 25.3,6.45 GLORY.1 25.45,6.45 27.13,8.13 29.72,8.13 34.29,12.7 D1.C
N$61
  Top 0.152: X6.3 48.16,53.54 48.16,52.63 47.55,52.02 42.67,52.02 39.17,55.52 39.17,58.27 38.41,59.03 37.49,59.03 35.66,57.2 SV9.2
N$62
  Top 0.152: S3.2 19.66,15.6 26.06,15.6 S3.1 26.21,15.44 29.57,15.44 29.72,15.29 33.68,15.29 34.9,16.51 34.9,18.03 37.49,20.62 | 47.24,10.87 49.07,12.7 R4.1 49.23,12.7 50.44,11.48 54.86,11.48 C7.1 | 47.24,10.87 46.79,10.41 46.79,8.89 R9.2 | 47.24,10.87 37.49,20.62 | 37.49,20.62 36.88,21.23 36.88,21.54 SV3.1 37.49,20.62
N$63  (via drill 0.35)
  Top 0.152: v45.72,39.98 45.72,37.54 IC1.42 | v45.72,43.33 48.46,43.33 49.53,44.4 | 49.53,44.4 52.58,41.35 65.53,41.35 67.06,42.88 67.06,43.03 68.12,44.09 68.28,44.09 73.61,49.43 SV8.1 | 49.53,44.4 SV5.5
  Bottom 0.152: v45.72,39.98 45.72,41.05 44.96,41.81 44.96,42.57 v45.72,43.33
N$64
  Top 0.152: SV9.1 35.2,59.33 38.56,59.33 39.47,58.42 39.47,55.68 42.82,52.32 46.94,52.32 47.4,52.78 47.4,53.54 X6.4
N$65  (via drill 0.35)
  Top 0.152: v20.73,2.03 17.68,5.08 17.68,6.15 12.8,11.02 12.8,12.39 SERIAL/ICSP.3
  Bottom 0.152: v20.73,2.03 46.48,2.03 SV1.5
N$66
  Top 0.152: SV8.9 71.78,27.33 71.78,23.67 74.83,20.62 74.83,20.32 PAD1.1
N$67
  Top 0.152: SV8.10 74.83,25.5 74.83,22.91 PAD2.1
VCC  (via drill 0.35)
  Top 0.152: IC2.7 3.96,39.98 4.42,39.98 5.18,39.22 5.18,37.08 4.88,36.78 2.74,36.78 2.59,36.63 2.59,35.71 4.27,34.04 6.25,34.04 C9.1 7.38,35.31 8.1,35.31 C8.1 10.21,33.88 13.87,30.23 13.87,26.72 RS232-1.4 | v63.09,36.93 60.65,39.37 R2.2 60.5,39.37 59.44,40.44 57.15,40.44 52.88,36.17 43.59,36.17 42.37,37.39 28.35,37.39 v27.28,36.32 | v64.77,35.25 66.9,33.12 C4.1
  Bottom 0.152: v64.77,35.25 v63.09,36.93 | 18.14,23.06 18.14,10.57 15.24,7.67 14.02,7.67 RS232-2.4 | 18.14,23.06 14.63,26.57 14.02,26.57 RS232-1.4 | v27.28,36.32 25.91,36.32 19.05,29.46 19.05,23.98 18.14,23.06
VDD  (via drill 0.35)
  Top 0.152: 54.86,7.52 52.43,9.96 51.05,9.96 49.99,8.89 R8.1 | 54.86,5.69 54.86,5.08 R6.2 54.86,5.69 | 54.86,5.69 54.86,7.52 | 54.86,7.52 56.84,9.5 | 56.84,9.5 66.75,19.41 67.21,19.41 OS1.4 | 54.86,5.69 42.82,5.69 41,3.86 40.69,3.86 SV1.2 | 35.36,22.76 35.36,20.47 33.22,18.34 33.22,16.51 F1.2 | 35.36,22.76 34.29,23.82 30.48,23.82 28.96,25.35 L1.2 | 53.49,16.66 51.36,16.66 47.4,12.7 R4.2 46.18,12.7 39.17,19.71 39.17,21.54 37.34,23.37 36.42,23.37 35.81,22.76 35.36,22.76 | SV4.9 53.49,16.66 | v57.91,21.39 57.91,27.94 L2.1 | 56.84,9.5 55.93,10.41 55.93,14.22 53.49,16.66 | C10.1 75.74,16.51 68.58,23.67 67.36,23.67 OS1.1 67.21,23.82 65.84,25.2 65.84,27.94 C6.1 65.68,27.94 65.68,30.68 63.86,32.51 v63.86,35.25
  Bottom 0.152: SV4.9 57.91,21.08 v57.91,21.39 57.91,26.42 44.2,40.13 44.2,43.18 43.43,43.94 43.43,45.77 | SV7.9 35.51,31.75 35.51,32.82 34.44,33.88 34.44,36.17 35.51,37.24 35.51,40.59 SV2.9 36.12,41.2 | 43.43,45.77 40.69,45.77 36.12,41.2 | 43.43,45.77 44.65,45.77 44.96,46.08 46.18,46.08 46.33,45.92 46.94,45.92 48.01,44.86 48.01,44.55 49.23,43.33 52.43,43.33 53.49,44.4 54.56,44.4 SV5.9 54.71,44.4 61.11,38 62.48,38 | 36.12,41.2 34.44,42.88 34.44,47.45 35.51,48.51 35.51,49.43 SV6.9 | 62.48,38 74.68,38 75.44,37.24 75.44,36.32 73.76,34.65 73.76,34.34 SV8.7 | v63.86,35.25 62.48,36.63 62.48,38
  pour Top: 17.78,11.43 29.21,11.43 29.21,3.81 17.78,3.81
VSS  (via drill 0.35)
  Top 0.152: C2.2 5.49,52.17 7.77,54.46 12.34,54.46 13.72,55.83 14.63,55.83 LED2.C 14.78,55.98 16.46,55.98 17.37,56.9 19.2,56.9 19.35,56.74 19.35,55.07 | JMP2.2 17.83,40.74 18.44,41.35 18.59,41.35 18.9,41.66 18.9,45.92 17.83,46.99 JMP1.2 17.68,46.99 15.7,48.97 15.7,52.02 C1.2 15.54,52.17 15.54,53.7 15.85,54 18.29,54 19.35,55.07 | v45.87,53.54 46.63,53.54 X6.5 | 60.96,55.98 61.72,56.74 72.85,56.74 73.61,55.98 73.61,55.83 74.83,54.61 X5.8 | K1.8 60.96,55.98 | v20.73,55.07 19.35,55.07 | 75.44,35.71 75.44,33.43 73.76,31.75 SV8.8 | 75.44,35.71 75.44,37.24 74.83,37.85 66.75,37.85 65.23,39.37 R1.1 | 56.24,18.8 54.71,20.32 SV4.10 | 56.24,18.8 56.69,18.34 56.69,11.48 C7.2 | C11.2 75.74,11.48 75.74,14.83 74.07,16.51 C10.2 72.85,16.51 66.75,22.61 66.29,22.61 63.7,25.2 | 63.7,25.2 63.7,27.94 | 63.7,25.2 62.33,23.82 OS1.2 62.18,23.67 61.11,23.67 56.24,18.8 | 61.57,33.88 63.7,31.75 63.7,27.94 | 61.57,33.88 61.42,34.04 59.74,34.04 58.83,33.12 C3.2 | 63.7,27.94 C6.2 | 75.44,35.71 65.23,35.71 65.08,35.87 63.55,35.87 61.57,33.88 | LED1.C 29.26,5.08 28.04,6.3 GLORY.2 27.89,6.45 26.21,8.13 24.99,8.13 23.32,6.45 21.64,6.45 POWER.2 | 31.7,5.38 31.39,5.08 LED1.C | 31.7,5.38 35.05,2.03 41.15,2.03 42.82,3.71 43.13,3.71 SV1.3 | SV7.10 38.1,31.75 IC1.6 43.13,31.75 43.89,32.51 53.95,32.51 IC1.29 | SV3.2 34.29,21.54 31.85,21.54 SV3.3 31.7,21.54 27.58,21.54 26.21,20.17 S3.3 | S3.6 26.36,17.88 26.36,19.86 26.21,20.02 S3.3 | S3.4 19.66,20.02 26.06,20.02 S3.3 | 60.96,55.98 57.3,59.64 54.71,59.64 TP1.TP | 31.7,5.38 32,5.69 32,8.89 D2.A | 31.7,5.38 LED1.C
  Bottom 0.152: SV6.10 37.03,53.54 v45.87,53.54 45.87,52.63 49.53,48.97 52.58,48.97 54.56,46.99 SV5.10 54.71,46.99 55.93,48.21 60.96,48.21 K1.8 | SV2.10 35.66,43.18 35.66,48.21 36.58,49.12 36.58,51.11 35.66,52.02 SV6.10 | v20.73,55.07 32.61,55.07 35.51,52.17 SV6.10 | 36.58,30.23 36.58,32.21 35.66,33.12 35.66,34.19 SV7.10 | 36.58,30.23 33.83,27.48 33.83,22.15 34.29,21.69 SV3.2 | 36.58,30.23 46.79,30.23 54.56,22.45 54.56,20.32 SV4.10 | X5.8 74.98,54.61 74.98,50.5 76.05,49.43 76.05,34.04 73.76,31.75 SV8.8 | 30.48,13.77 26.52,17.73 S3.6 | 30.48,13.77 38.41,13.77 39.01,13.16 39.01,12.24 33.22,6.45 28.04,6.45 GLORY.2 | 30.48,13.77 D1.A

### Text on the board
Top: FGB@MCHP 1.5 | ELO SMART CONVERTER | These are the controllers you are looking for!